# EAGLE design lora_card (EAGLE 9.6.2)
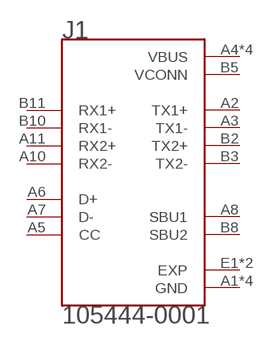
[diagram p0: schematic, sheet 1]

## Parts
J1  105444-0001  [MOLEX_105444-0001]
Unconnected: J1.A2(TX1+) J1.A3(TX1-) J1.A5(CC) J1.A6(D+) J1.A7(D-) J1.A8(SBU1) J1.A10(RX2-) J1.A11(RX2+) J1.B2(TX2+) J1.B3(TX2-) J1.B8(SBU2) J1.B10(RX1-) J1.B11(RX1+) J1.E1(EXP) J1.E2(EXP)

## Power pins joined to a net without a drawn wire
GND: J1.A1(GND) J1.A12(GND) J1.B1(GND) J1.B12(GND)
VBUS: J1.A4(VBUS) J1.A9(VBUS) J1.B4(VBUS) J1.B9(VBUS)
VCONN: J1.B5(VCONN)

## Library data of the parts
J1 = MOLEX_105444-0001:105444-0001: USB Shielded I/O Plug; Type C; Right Angle; Surface Mount; 0.76µm Gold Plating; DESCRIPTION: USB-C (USB TYPE-C) USB 3.2 Gen 2 (USB 3.1 Gen 2, Superspeed + (USB 3.1)) Plug Connector 24 Position Board Edge, Straddle Mount; DIGI-KEY_PART_NUMBER: WM12855-ND; MF: Molex; MP: 1054440001; PACKAGE: None; PURCHASE-URL: https://pricing.snapeda.com/search/part/1054440001/?ref=eda

## Board
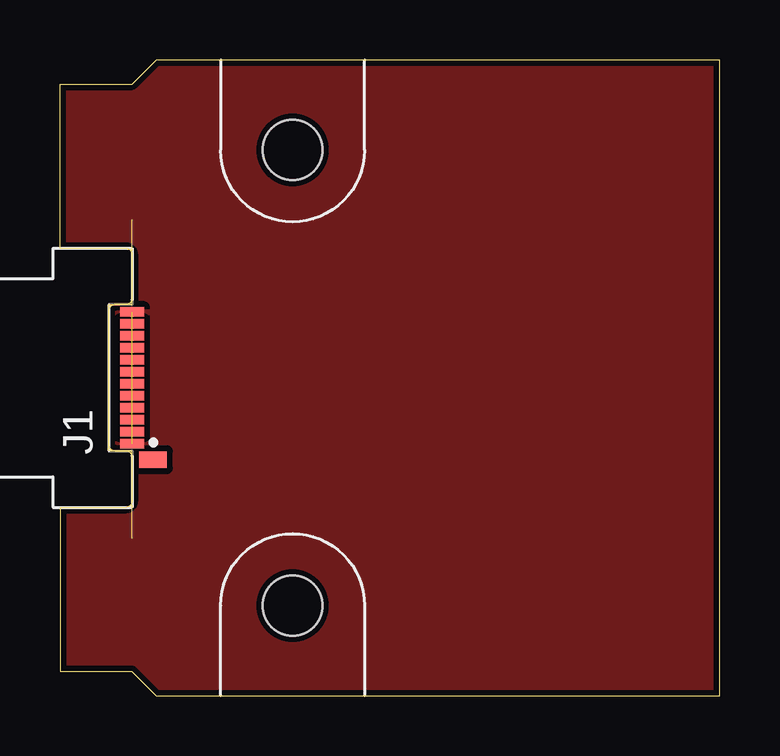
[diagram p1: board, top side]
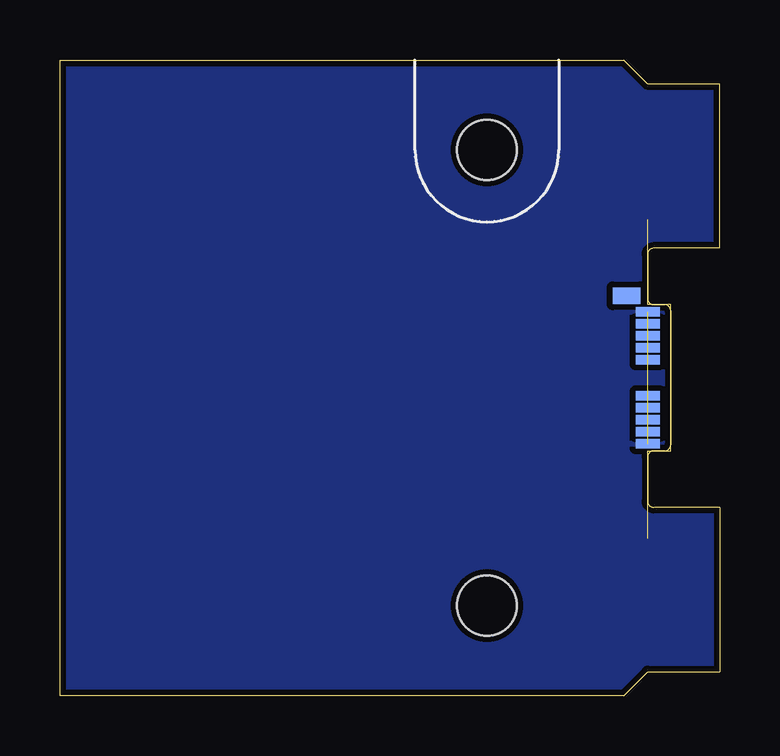
[diagram p2: board, bottom side, seen from below]

Size 27.5 x 26.5 mm. Coordinates in mm from the lower left corner, seen from the top.
Outline: 4,0 27.5,0 27.5,26.5 4,26.5 3,25.5 0,25.5 0,18.65 2.75,18.65 arc-90 3,18.4 3,16.55 arc-90 2.75,16.3 2.29,16.3 arc90 2.04,16.05 2.04,10.45 arc90 2.29,10.2 2.75,10.2 arc-90 3,9.95 3,8.1 arc-90 2.75,7.85 0,7.85 0,1 3,1 4,0
Copper layers (1*16): Top 0.035mm / dielectric 1.5mm / Bottom 0.035mm
Design rules "default *": minimum track width 4mil, minimum drill 0.25mm, track to track 4mil, track to pad 4mil, pad to pad 4mil, via to via 4mil, smd to smd 4mil, copper to edge 10mil, drill to drill 6mil, minimum pad ring 5mil, minimum via ring 5mil, stop-mask expansion 0mil, vias tented up to drill 0.25mm, thermal gap 10mil
Holes 2.5 mm at 9.7,3.75 9.7,22.75

### Footprints (pad centres in the part's own frame; a part is rotated, then mirrored left to right if it is on the bottom)
MOLEX_105444-0001 = smd 0.38 x 1: A1 -2.75,0; A2 -2.25,0; A3 -1.75,0; A4 -1.25,0; A5 -0.75,0; A6 -0.25,0; A7 0.25,0; A8 0.75,0; A9 1.25,0; A10 1.75,0; A11 2.25,0; A12 2.75,0 | smd 0.38 x 1 bottom: B1 2.75,0; B2 2.25,0; B3 1.75,0; B4 1.25,0; B5 0.75,0; B8 -0.75,0; B9 -1.25,0; B10 -1.75,0; B11 -2.25,0; B12 -2.75,0 | smd 0.7 x 1.15: E1 -3.42,-0.88 | smd 0.7 x 1.15 bottom: E2 3.42,-0.88

### Placement (x,y rotation side)
J1  3,13.25 90 top

### Tracks (layer width: path | path; a pad name or v marks a point on that pad's centre or on a via)
GND  (3 unrouted)
  pour Top (isolate 0.25): 0,26.5 27.5,26.5 27.5,0 0,0
  pour Bottom (isolate 0.25): 0,26.5 27.5,26.5 27.5,0 0,0
VBUS  (3 unrouted)